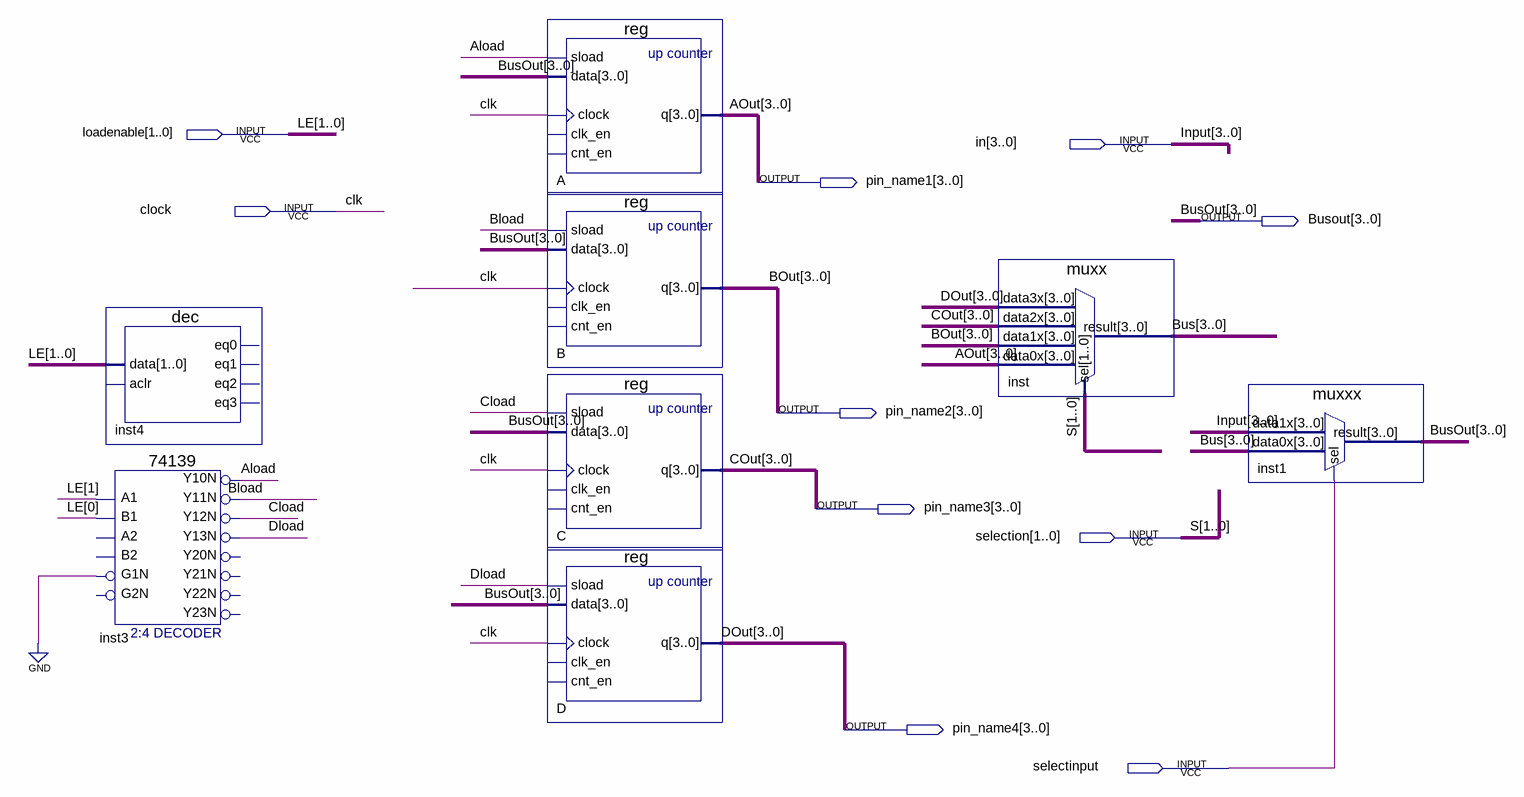
[diagram p0: schematic sheet]
// Quartus schematic bussystem.bdf as structural Verilog: 8 symbols, 10 pins
module bussystem (
  input  [1:0] loadenable,
  input  [3:0] in,
  input  clock,
  input  [1:0] selection,
  input  selectinput,
  output [3:0] pin_name1,
  output [3:0] Busout,
  output [3:0] pin_name2,
  output [3:0] pin_name3,
  output [3:0] pin_name4
);

  wire Aload, Bload, Cload, Dload;
  wire [3:0] Bus;

  dec inst4 (.data(loadenable));  // open: aclr, eq0, eq1, eq2, eq3
  \74139  inst3 (
    .A1(loadenable[1]), .B1(loadenable[0]), .G1N(1'b0), .Y10N(Aload), .Y13N(Dload), .Y12N(Cload), .Y11N(Bload));  // open: A2, B2, G2N, Y20N, Y21N, Y22N, Y23N
  \reg  A (.sload(Aload), .data(Busout), .clock(clock), .q(pin_name1));  // open: clk_en, cnt_en
  \reg  B (.sload(Bload), .data(Busout), .clock(clock), .q(pin_name2));  // open: clk_en, cnt_en
  \reg  C (.sload(Cload), .data(Busout), .clock(clock), .q(pin_name3));  // open: clk_en, cnt_en
  \reg  D (.sload(Dload), .data(Busout), .clock(clock), .q(pin_name4));  // open: clk_en, cnt_en
  muxx inst (
    .data3x(pin_name4), .data2x(pin_name3), .data1x(pin_name2), .data0x(pin_name1), .sel(selection),
    .result(Bus));
  muxxx inst1 (.data1x(in), .data0x(Bus), .sel(selectinput), .result(Busout));

  // Other names for the same wires on the sheet: AOut[3:0] = pin_name1; BOut[3:0] = pin_name2; clk = clock;
  //   COut[3:0] = pin_name3; DOut[3:0] = pin_name4; Input[3:0] = in; LE[1:0] = loadenable; S[1:0] = selection
endmodule
